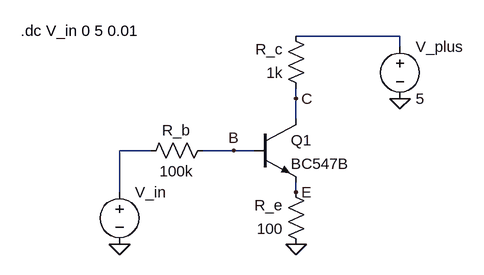
[diagram p0: schematic 2.2_a.asc]
2.2_a.asc, the LTspice schematic file:
Version 4.1
SHEET 1 880 680
WIRE 416 16 256 16
WIRE 416 32 416 16
WIRE 256 112 256 96
WIRE 256 144 256 112
WIRE 32 192 -16 192
WIRE 160 192 112 192
WIRE 192 192 160 192
WIRE -16 256 -16 192
WIRE 256 256 256 240
FLAG -16 336 0
FLAG 256 336 0
FLAG 416 112 0
FLAG 256 112 C
FLAG 256 256 E
FLAG 160 192 B
SYMBOL npn 192 144 R0
SYMATTR InstName Q1
SYMATTR Value BC547B
SYMBOL voltage 416 16 R0
SYMATTR InstName V_plus
SYMATTR Value 5
SYMBOL voltage -16 240 R0
SYMATTR InstName V_in
SYMATTR Value ""
SYMBOL res 128 176 R90
WINDOW 0 0 56 VBottom 2
WINDOW 3 32 56 VTop 2
SYMATTR InstName R_b
SYMATTR Value 100k
SYMBOL res 272 112 R180
WINDOW 0 36 76 Left 2
WINDOW 3 36 40 Left 2
SYMATTR InstName R_c
SYMATTR Value 1k
SYMBOL res 272 352 R180
WINDOW 0 36 76 Left 2
WINDOW 3 36 40 Left 2
SYMATTR InstName R_e
SYMATTR Value 100
TEXT -168 8 Left 2 !.dc V_in 0 5 0.01

The netlist it stands for:
* 2.2_a.asc
Q1 C B E 0 BC547B
V_plus N001 0 5
V_in N002 0
R_b B N002 100k
R_c C N001 1k
R_e 0 E 100
.model NPN NPN
.model PNP PNP
.lib standard.bjt
.dc V_in 0 5 0.01
.backanno
.end